# Altium project ZED-F20P-00B Breakout V1.PrjPcb
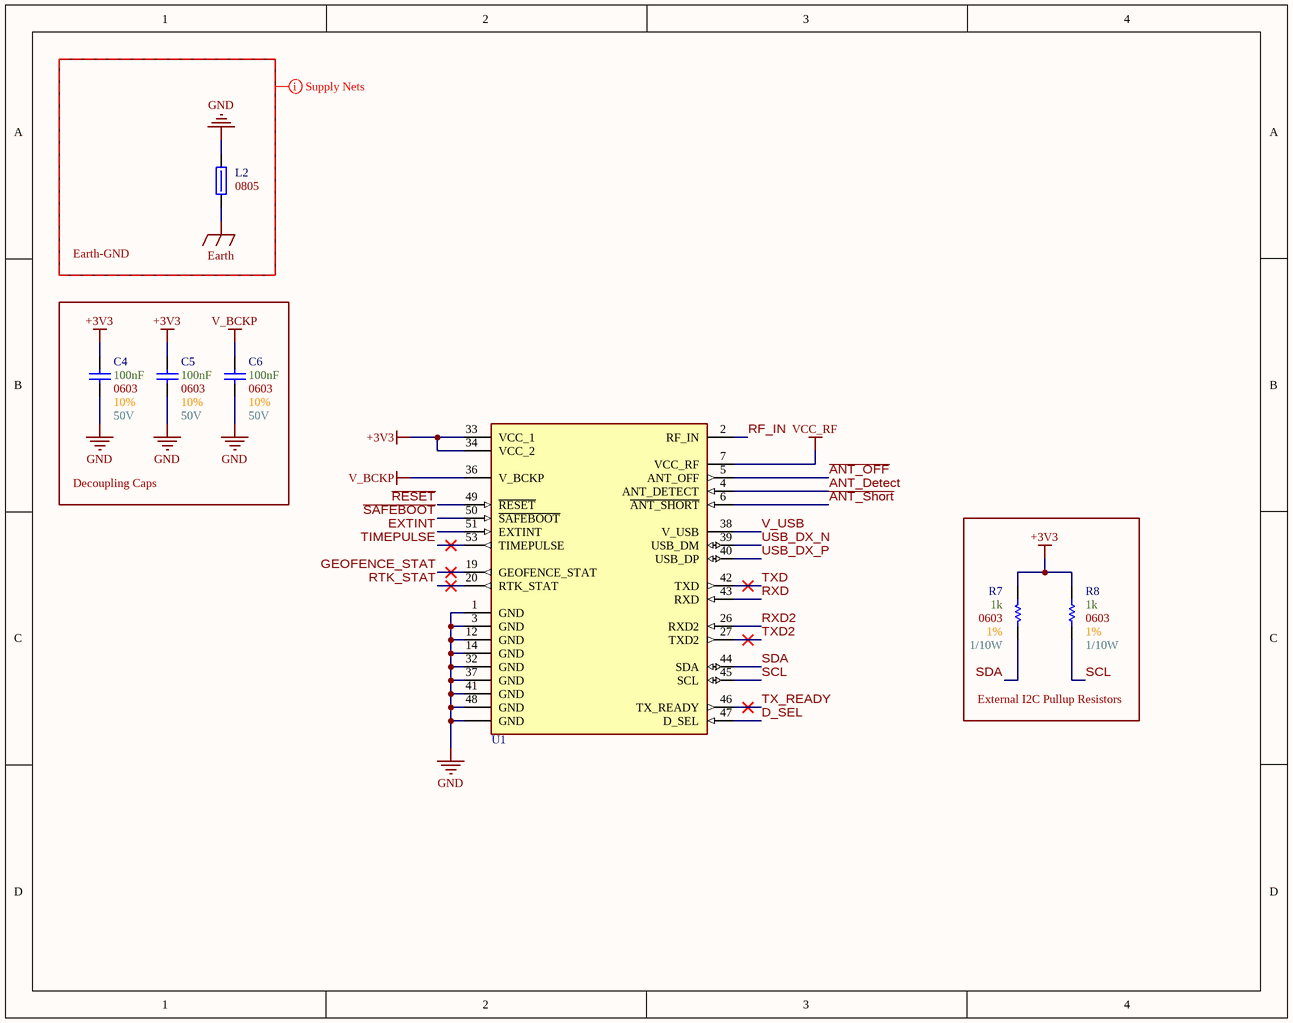
[diagram p0: Main.SchDoc]
6 sheets, 44 parts. Net scope: global (net labels, ports and power ports of the same name join across sheets).
Board file: Layout.PcbDoc
Sheets:
  Main.SchDoc
  USB.SchDoc
  Power.SchDoc
  Antenna Supervisory Circuit.SchDoc
  PIO Isolation.SchDoc
  Breakout Connections.SchDoc

## Sheet Main.SchDoc
size A; SheetNumber: 1; SheetTotal: 6

### Parts
C4  Max Voltage: 50V  Size Package: 0603  Tolerance: 10%  Capacitance: 100nF  [[Cap] SMD 0603]  (hidden comment: [Cap] 0603 0.1uF 10% 50V)
C5  Max Voltage: 50V  Size Package: 0603  Tolerance: 10%  Capacitance: 100nF  [[Cap] SMD 0603]  (hidden comment: [Cap] 0603 0.1uF 10% 50V)
C6  Max Voltage: 50V  Size Package: 0603  Tolerance: 10%  Capacitance: 100nF  [[Cap] SMD 0603]  (hidden comment: [Cap] 0603 0.1uF 10% 50V)
L2  Size Package: 0805  [[Ferrite] SMD 0805]  (hidden comment: 652-MH2029-300Y)
R7  Wattage: 1/10W  Tolerance: 1%  Resistance: 1k  Size Package: 0603  [[Res] SMD 0603]  (hidden comment: [1k] SMD 0603 1% 1/10W)
R8  Wattage: 1/10W  Tolerance: 1%  Resistance: 1k  Size Package: 0603  [[Res] SMD 0603]  (hidden comment: [1k] SMD 0603 1% 1/10W)
U1  High-Precision Triple Band GNSS Module  [[GNSS] ZED-F20P-00B]  (value not drawn)

### Blocks framed on the sheet
Earth-GND: L2
Decoupling Caps: C4-C6
External I2C Pullup Resistors: R7 R8

### Nets
+3V3: C4.2 C5.2 R7.2 R8.2 U1.33(VCC_1) U1.34(VCC_2)
Earth: L2.1
GND: C4.1 C5.1 C6.1 L2.2 U1.1(GND) U1.3(GND) U1.12(GND) U1.14(GND) U1.32(GND) U1.37(GND) U1.41(GND) U1.48(GND) U1.GND
V_BCKP: C6.2 U1.36(V_BCKP)
VCC_RF: U1.7(VCC_RF)
~{ANT_OFF}: U1.5(ANT_OFF)
~{ANT_Short}: U1.6(~{ANT_SHORT})
~{RESET}: U1.49(~{RESET})
~{SAFEBOOT}: U1.50(~{SAFEBOOT})
ANT_Detect: U1.4(ANT_DETECT)
D_SEL: U1.47(D_SEL)
EXTINT: U1.51(EXTINT)
GEOFENCE_STAT: U1.19(GEOFENCE_STAT)
RF_IN: U1.2(RF_IN)
RTK_STAT: U1.20(RTK_STAT)
RXD: U1.43(RXD)
RXD2: U1.26(RXD2)
SCL: R8.1 U1.45(SCL)
SDA: R7.1 U1.44(SDA)
TIMEPULSE: U1.53(TIMEPULSE)
TX_READY: U1.46(TX_READY)
TXD: U1.42(TXD)
TXD2: U1.27(TXD2)
USB_DX_N: U1.39(USB_DM)
USB_DX_P: U1.40(USB_DP)
V_USB: U1.38(V_USB)

### Layout directives
net class Supply_Nets: Earth, GND

### Library data of the parts
C4-C6 = [Cap] 0603 0.1uF 10% 50V: CL10B104KB8NNNC; Supplier 1: DigiKey; Supplier Part Number 1: 1276-1000-6-ND
L2 = [Ferrite] SMD 0805 3A 30ohm: Res @ Freq: 30 @ 100MHz; Supplier 1: DigiKey; Supplier Part Number 1: MH2029-300YCT-ND
R7 R8 = [1k] SMD 0603 1% 1/10W: RMCF0603FT1K00; Supplier 1: DigiKey; Supplier Part Number 1: RMCF0603FT1K00DKR-ND
U1 = [GNSS] ZED-F20P-00B: ZED-F20P-00B; Supplier 1: DigiKey; Supplier Part Number 1: 672-ZED-F20P-00BDKR-ND

## Sheet USB.SchDoc
size A; SheetNumber: 2; SheetTotal: 6
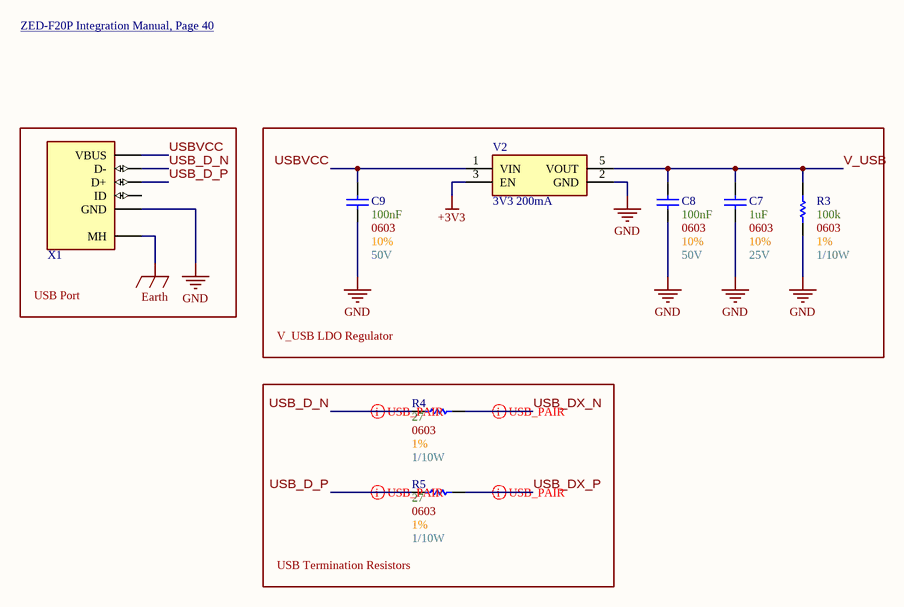
[diagram p1: USB.SchDoc]

### Parts
C7  Max Voltage: 25V  Size Package: 0603  Tolerance: 10%  Capacitance: 1uF  [[Cap] SMD 0603]  (hidden comment: [Cap] 0603 1uF 10% 25V)
C8  Max Voltage: 50V  Size Package: 0603  Tolerance: 10%  Capacitance: 100nF  [[Cap] SMD 0603]  (hidden comment: [Cap] 0603 0.1uF 10% 50V)
C9  Max Voltage: 50V  Size Package: 0603  Tolerance: 10%  Capacitance: 100nF  [[Cap] SMD 0603]  (hidden comment: [Cap] 0603 0.1uF 10% 50V)
R3  Wattage: 1/10W  Tolerance: 1%  Resistance: 100k  Size Package: 0603  [[Res] SMD 0603]  (hidden comment: [100k] SMD 0603 1% 1/10W)
R4  Wattage: 1/10W  Tolerance: 1%  Resistance: 27  Size Package: 0603  [[Res] SMD 0603]  (hidden comment: [27] SMD 0603 1% 1/10W)
R5  Wattage: 1/10W  Tolerance: 1%  Resistance: 27  Size Package: 0603  [[Res] SMD 0603]  (hidden comment: [27] SMD 0603 1% 1/10W)
V2  3V3 200mA  [[Linear] 3V3 0.2A]
X1  [USB] Type-B Mini  [[USB] Type-B Mini]  (value not drawn)

### Blocks framed on the sheet
USB Port: X1
V_USB LDO Regulator: C7-C9 R3 V2
USB Termination Resistors: R4 R5

### Nets
+3V3: V2.3(EN)
Earth: X1.MH
GND: C7.1 C8.1 C9.1 R3.1 V2.2(GND) X1.5(GND)
USB_D_N: R4.1 X1.2(D-)
USB_D_P: R5.1 X1.3(D+)
USB_DX_N: R4.2
USB_DX_P: R5.2
USBVCC: C9.2 V2.1(VIN) X1.1(VBUS)
V_USB: C7.2 C8.2 R3.2 V2.5(VOUT)

Not connected (* = marked no-connect by the designer): X1 4(ID)

### Layout directives
differential pair; differential pair class USB_Pairs: USB_D_N, USB_D_P, USB_DX_N, USB_DX_P

### Notes on the sheet
- ZED-F20P Integration Manual, Page 40 <https://content.u-blox.com/sites/default/files/documents/ZED-F20P_IntegrationManual_UBXDOC-304424225-19671.pdf#page=40>

### Library data of the parts
C7 = [Cap] 0603 1uF 10% 25V: CL10B105KA8NNNC; Supplier 1: DigiKey; Supplier Part Number 1: 1276-1184-1-ND
C8 C9 = [Cap] 0603 0.1uF 10% 50V: CL10B104KB8NNNC; Supplier 1: DigiKey; Supplier Part Number 1: 1276-1000-6-ND
R3 = [100k] SMD 0603 1% 1/10W: RC0603FR-07100KL; Supplier 1: DigiKey; Supplier Part Number 1: 311-100KHRDKR-ND
R4 R5 = [27] SMD 0603 1% 1/10W: MCT06030C2709FP500; Supplier 1: DigiKey; Supplier Part Number 1: 749-1631-1-ND
V2 = [Linear] 3V3 0.2A: TCR2EF33,LM(CT; Supplier 1: DigiKey; Supplier Part Number 1: TCR2EF33LM(CTDKR-ND
X1 = [USB] Type-B Mini: MUSB-05-S-B-SM-A-K-TR; Supplier 1: DigiKey; Supplier Part Number 1: SAM14226CT-ND

## Sheet Power.SchDoc
size A; SheetNumber: 3; SheetTotal: 6
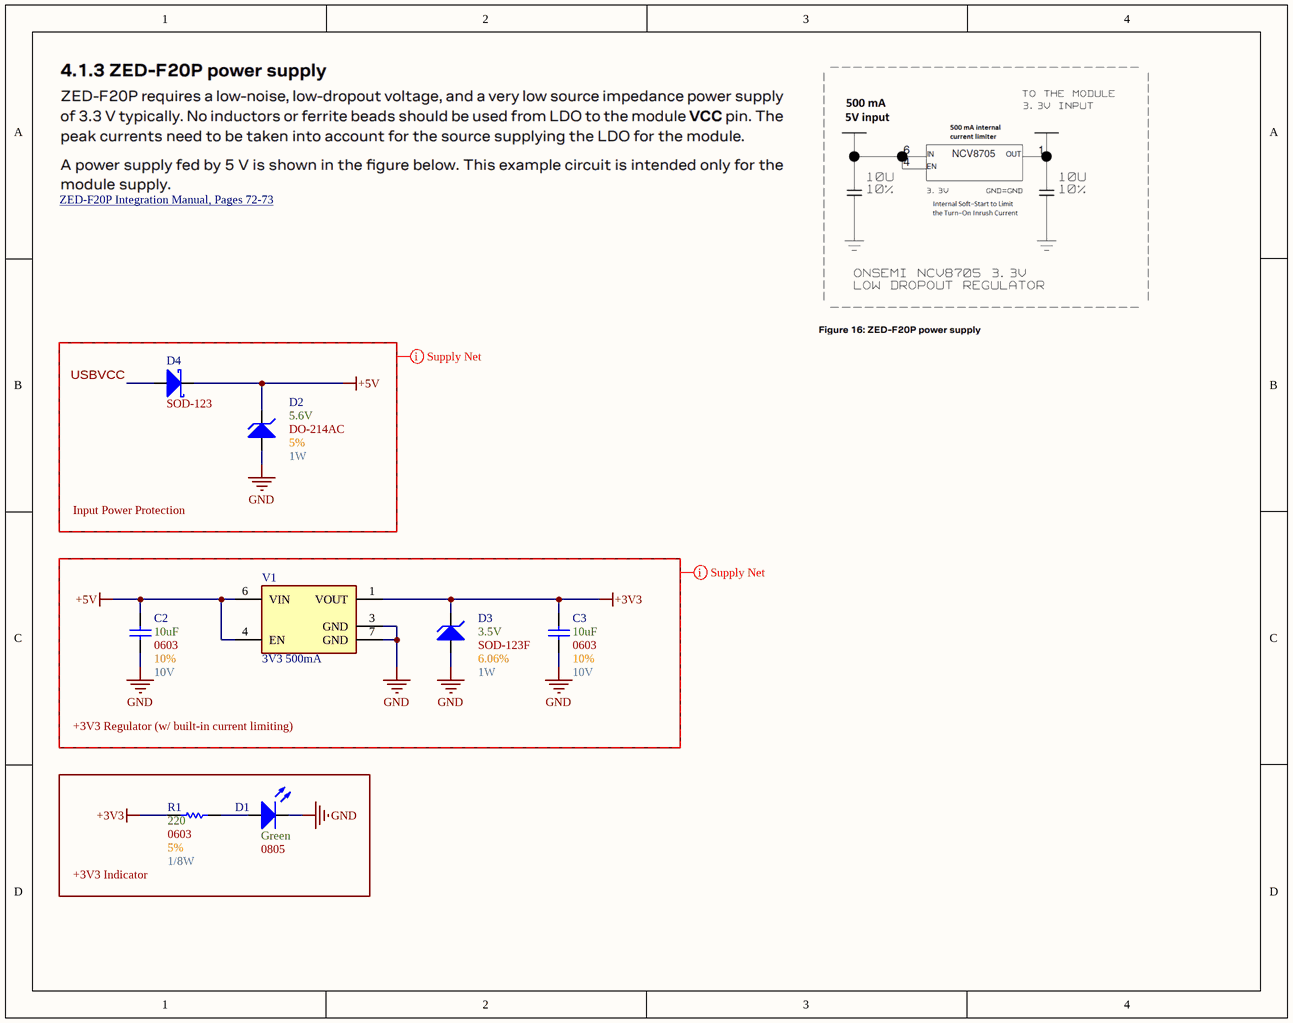
[diagram p2: Power.SchDoc]

### Parts
C2  Max Voltage: 10V  Size Package: 0603  Tolerance: 10%  Capacitance: 10uF  [[Cap] SMD 0603]  (hidden comment: [Cap] 0603 10uF 10% 10V)
C3  Max Voltage: 10V  Size Package: 0603  Tolerance: 10%  Capacitance: 10uF  [[Cap] SMD 0603]  (hidden comment: [Cap] 0603 10uF 10% 10V)
D1  Color: Green  Size Package: 0805  [[LED] SMD 0805]  (hidden comment: [LED] SMD 0805 Green)
D2  Tolerance: 5%  Wattage: 1W  Optimal Zener Voltage: 5.6V  [[Diode] SMD DO-214AC]  (hidden comment: DO-214AC)
D3  Tolerance: 6.06%  Wattage: 1W  Optimal Zener Voltage: 3.5V  [[Diode] SOD-123F]  (hidden comment: SOD-123F)
D4  Footprint: SOD-123  [[Diode] SMD SOD-123]  (hidden comment: SOD123)
R1  Wattage: 1/8W  Tolerance: 5%  Resistance: 220  Size Package: 0603  [[Res] SMD 0603]  (hidden comment: [220] SMD 0603 5% 1/10W)
V1  3V3 500mA  [[Linear] 3V3 0.5A]

### Blocks framed on the sheet
Input Power Protection: D2 D4
+3V3 Regulator (w/ built-in current limiting): C2 C3 D3 V1
+3V3 Indicator: D1 R1

### Nets
+3V3: C3.2 D3.1(K) R1.1 V1.1(VOUT)
+5V: C2.2 D2.1(K) D4.1(K) V1.4(EN) V1.6(VIN)
GND: C2.1 C3.1 D1.2(Cathode) D2.2(A) D3.2(A) V1.3(GND) V1.7(GND)
USBVCC: D4.2(A)
NetD1_1: D1.1(Anode) R1.2

### Layout directives
net class Supply_Nets: +3V3, +5V, GND, USBVCC

### Notes on the sheet
- ZED-F20P Integration Manual, Pages 72-73 <https://content.u-blox.com/sites/default/files/documents/ZED-F20P_IntegrationManual_UBXDOC-304424225-19671.pdf#page=72>

### Library data of the parts
C2 C3 = [Cap] 0603 10uF 10% 10V: CL10A106KP8NNNC; Supplier 1: DigiKey; Supplier Part Number 1: 1276-1192-6-ND
D1 = [LED] SMD 0805 Green: LG R971-KN-1-0-20-R18; Supplier 1: DigiKey; Supplier Part Number 1: 475-LGR971-KN-1CT-ND
D2 = [Zener] SMD 5.6V 1W 5%: SMAZ5V6-13-F; Supplier 1: DigiKey; Supplier Part Number 1: SMAZ5V6-FDICT-ND; Footprint: DO-214AC
D3 = [Zener] SMD 3.5V 1W 6%: KDZVTR3.3B; Supplier 1: DigiKey; Supplier Part Number 1: 846-KDZVTR3.3BCT-ND; Footprint: SOD-123F
D4 = [Schottky] SMD 40V 1A: B5819W-TP; Supplier 1: DigiKey; Supplier Part Number 1: B5819W-TPMSCT-ND
R1 = [220] SMD 0603 5% 1/10W: RK73B1JTTD221J; Supplier 1: DigiKey; Supplier Part Number 1: 2019-RK73B1JTTD221JDKR-ND
V1 = [Linear] 3V3 0.5A: NCV8705MT33TCG; Supplier 1: DigiKey; Supplier Part Number 1: NCV8705MT33TCGOSDKR-ND

## Sheet Antenna Supervisory Circuit.SchDoc
size A; SheetNumber: 4; SheetTotal: 6
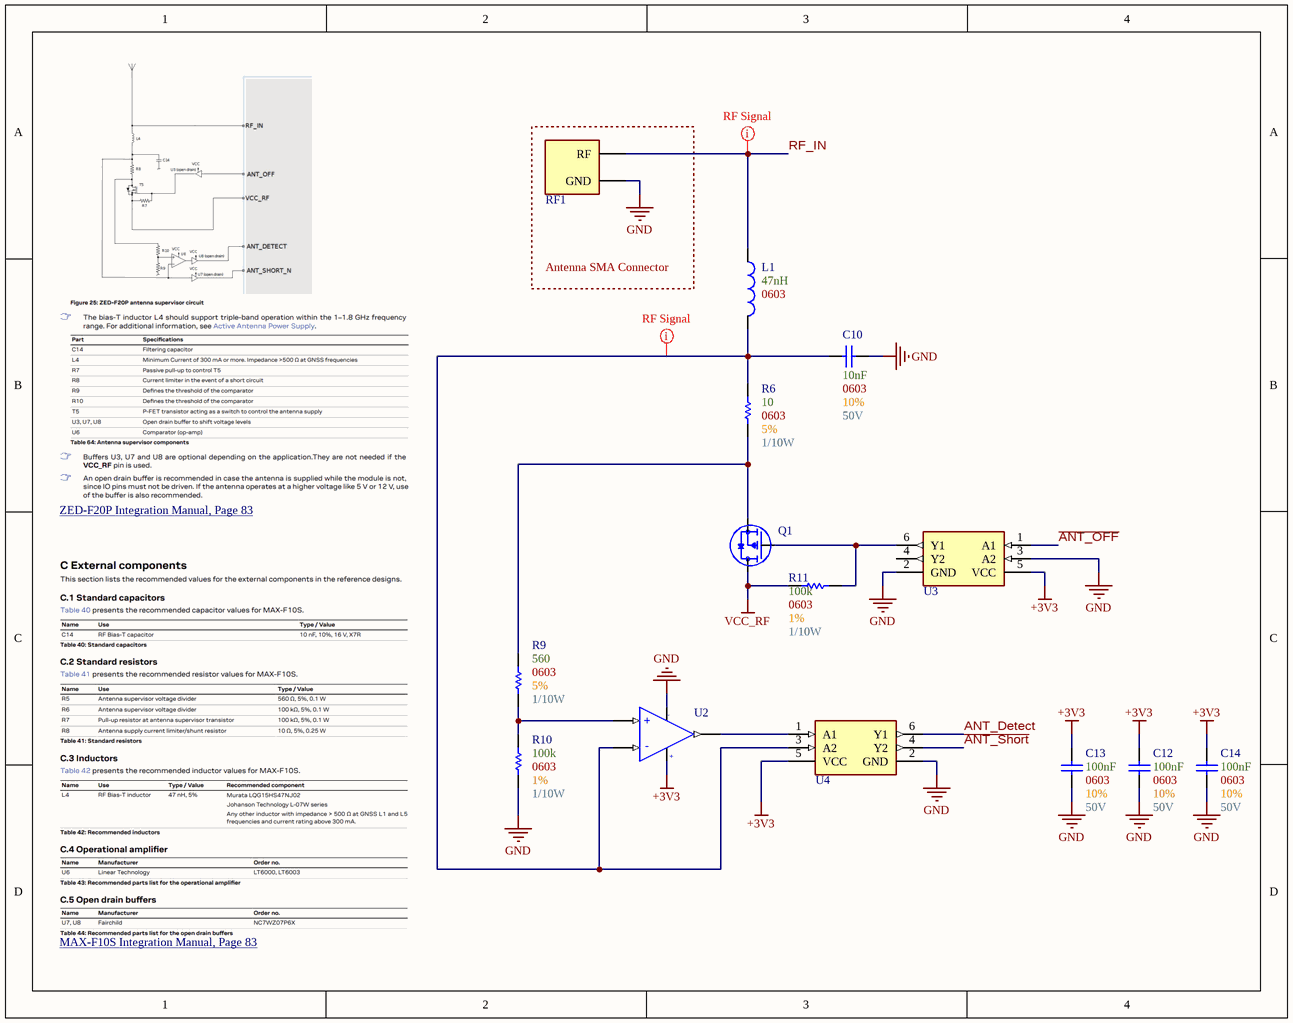
[diagram p3: Antenna Supervisory Circuit.SchDoc]

### Parts
C10  Max Voltage: 50V  Size Package: 0603  Tolerance: 10%  Capacitance: 10nF  [[Cap] SMD 0603]  (hidden comment: [Cap] 0603 0.01uF 10% 50V)
C12  Max Voltage: 50V  Size Package: 0603  Tolerance: 10%  Capacitance: 100nF  [[Cap] SMD 0603]  (hidden comment: [Cap] 0603 0.1uF 10% 50V)
C13  Max Voltage: 50V  Size Package: 0603  Tolerance: 10%  Capacitance: 100nF  [[Cap] SMD 0603]  (hidden comment: [Cap] 0603 0.1uF 10% 50V)
C14  Max Voltage: 50V  Size Package: 0603  Tolerance: 10%  Capacitance: 100nF  [[Cap] SMD 0603]  (hidden comment: [Cap] 0603 0.1uF 10% 50V)
L1  Package: 0603  Inductance: 47nH  [[Inductor] SMD 0603]  (hidden comment: [47nH] SMD 0603 90mA)
Q1  [PMOS] SMD 20V 1A 200mOhm  [SOT323]  (value not drawn)
R6  Wattage: 1/10W  Tolerance: 5%  Resistance: 10  Size Package: 0603  [[Res] SMD 0603]  (hidden comment: [10] SMD 0603 5% 1/10W)
R9  Wattage: 1/10W  Tolerance: 5%  Resistance: 560  Size Package: 0603  [[Res] SMD 0603]  (hidden comment: [560] SMD 0603 5% 1/10W)
R10  Wattage: 1/10W  Tolerance: 1%  Resistance: 100k  Size Package: 0603  [[Res] SMD 0603]  (hidden comment: [100k] SMD 0603 1% 1/10W)
R11  Wattage: 1/10W  Tolerance: 1%  Resistance: 100k  Size Package: 0603  [[Res] SMD 0603]  (hidden comment: [100k] SMD 0603 1% 1/10W)
RF1  [SMA] 90deg Thru-Hole  [[SMA] 90deg Thru-Hole]  (value not drawn)
U2  [Op-Amp] Rail-to-Rail Vmax=16V GBP=3kHz  [[Op-Amp] Rail-to-Rail Vmax=16V GBP=3kHz]  (value not drawn)
U3  [Buffer] Dual Open Drain  [[Buffer] Dual Open Drain]  (value not drawn)
U4  [Buffer] Dual Open Drain  [[Buffer] Dual Open Drain]  (value not drawn)

### Blocks framed on the sheet
Antenna SMA Connector: RF1

### Nets
+3V3: C12.2 C13.2 C14.2 U2.5(V+) U3.5(VCC) U4.5(VCC)
GND: C10.1 C12.1 C13.1 C14.1 R10.1 RF1.2(GND) U2.2(V-) U3.2(GND) U3.3(A2) U4.2(GND)
VCC_RF: Q1.2(Source) R11.2
~{ANT_OFF}: U3.1(A1)
~{ANT_Short}: U4.4(Y2)
ANT_Detect: U4.6(Y1)
RF_IN: L1.1 RF1.1(RF)
NetC10_2: C10.2 L1.2 R6.2 U2.4(-IN) U4.3(A2)
NetQ1_1: Q1.1(Gate) R11.1 U3.6(Y1)
NetQ1_3: Q1.3(Drain) R6.1 R9.2
NetR9_1: R9.1 R10.2 U2.3(+IN)
NetU2_1: U2.1(OUT) U4.1(A1)

Not connected (* = marked no-connect by the designer): U3 4(Y2)

### Layout directives
net class nRF Signal: NetC10_2, RF_IN

### Notes on the sheet
- ZED-F20P Integration Manual, Page 83 <https://content.u-blox.com/sites/default/files/documents/ZED-F20P_IntegrationManual_UBXDOC-304424225-19671.pdf#page=83>
- MAX-F10S Integration Manual, Page 83 <https://content.u-blox.com/sites/default/files/documents/MAX-F10S_IntegrationManual_UBXDOC-963802114-12892.pdf#page=83>
- (in symbol [Op-Amp] Rail-to-Rail Vmax=16V GBP=3kHz) -; +

### Library data of the parts
C10 = [Cap] 0603 0.01uF 10% 50V: C0603C103K5RACTU; Supplier 1: DigiKey; Supplier Part Number 1: 399-C0603C103K5RACTUDKR-ND
C12-C14 = [Cap] 0603 0.1uF 10% 50V: CL10B104KB8NNNC; Supplier 1: DigiKey; Supplier Part Number 1: 1276-1000-6-ND
L1 = [47nH] SMD 0603 90mA: AIMC-0603-47NJ-T; Supplier 1: DigiKey; Supplier Part Number 1: 535-11541-6-ND
Q1 = [PMOS] SMD 20V 1A 200mOhm: PMF170XP,115; Supplier 1: DigiKey; Supplier Part Number 1: 1727-1229-6-ND
R6 = [10] SMD 0603 5% 1/10W: RC0603JR-1310RL; Supplier 1: DigiKey; Supplier Part Number 1: 13-RC0603JR-1310RLDKR-ND
R9 = [560] SMD 0603 5% 1/10W: RC0603JR-07560RL; Supplier 1: DigiKey; Supplier Part Number 1: 311-560GRDKR-ND
R10 R11 = [100k] SMD 0603 1% 1/10W: RC0603FR-07100KL; Supplier 1: DigiKey; Supplier Part Number 1: 311-100KHRDKR-ND
RF1 = [SMA] 90deg Thru-Hole: RFPC-SMA27-F; Supplier 1: DigiKey; Supplier Part Number 1: 2073-RFPC-SMA27-F-ND
U2 = [Op-Amp] Rail-to-Rail Vmax=16V GBP=3kHz: LT6003CS5#TRMPBF; Supplier 1: DigiKey; Supplier Part Number 1: 505-LT6003CS5#TRMPBFCT-ND
U3 U4 = [Buffer] Dual Open Drain: NC7WZ07P6X; Supplier 1: DigiKey; Supplier Part Number 1: NC7WZ07P6XDKR-ND

## Sheet PIO Isolation.SchDoc
size A; SheetNumber: 5; SheetTotal: 6
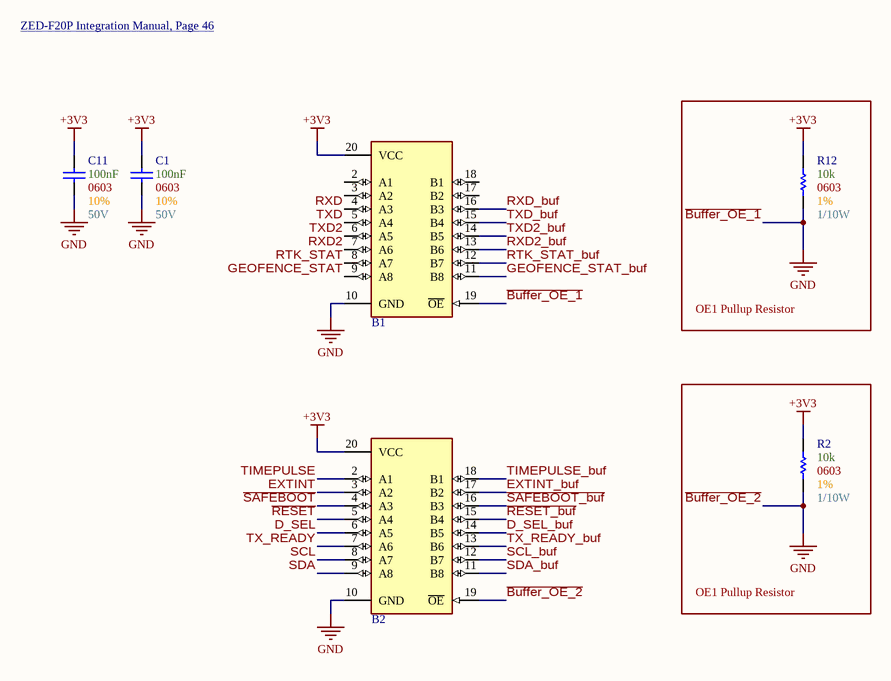
[diagram p4: PIO Isolation.SchDoc]

### Parts
B1  [Isolation Buffer] Bus Switch x8  [[Isolation Buffer] Bus Switch x8]  (value not drawn)
B2  [Isolation Buffer] Bus Switch x8  [[Isolation Buffer] Bus Switch x8]  (value not drawn)
C1  Max Voltage: 50V  Size Package: 0603  Tolerance: 10%  Capacitance: 100nF  [[Cap] SMD 0603]  (hidden comment: [Cap] 0603 0.1uF 10% 50V)
C11  Max Voltage: 50V  Size Package: 0603  Tolerance: 10%  Capacitance: 100nF  [[Cap] SMD 0603]  (hidden comment: [Cap] 0603 0.1uF 10% 50V)
R2  Wattage: 1/10W  Tolerance: 1%  Resistance: 10k  Size Package: 0603  [[Res] SMD 0603]  (hidden comment: [10k] SMD 0603 1% 1/8W)
R12  Wattage: 1/10W  Tolerance: 1%  Resistance: 10k  Size Package: 0603  [[Res] SMD 0603]  (hidden comment: [10k] SMD 0603 1% 1/8W)

### Blocks framed on the sheet
OE1 Pullup Resistor: R12
OE1 Pullup Resistor: R2

### Nets
+3V3: B1.20(VCC) B2.20(VCC) C1.2 C11.2 R2.2 R12.2
GND: B1.10(GND) B1.19(~{OE}) B2.10(GND) B2.19(~{OE}) C1.1 C11.1 R2.1 R12.1  [also labelled ~{Buffer_OE_1}, ~{Buffer_OE_2}]
~{RESET}: B2.5(A4)
~{RESET_buf}: B2.15(B4)
~{SAFEBOOT}: B2.4(A3)
~{SAFEBOOT_buf}: B2.16(B3)
D_SEL: B2.6(A5)
D_SEL_buf: B2.14(B5)
EXTINT: B2.3(A2)
EXTINT_buf: B2.17(B2)
GEOFENCE_STAT: B1.9(A8)
GEOFENCE_STAT_buf: B1.11(B8)
RTK_STAT: B1.8(A7)
RTK_STAT_buf: B1.12(B7)
RXD: B1.4(A3)
RXD2: B1.7(A6)
RXD2_buf: B1.13(B6)
RXD_buf: B1.16(B3)
SCL: B2.8(A7)
SCL_buf: B2.12(B7)
SDA: B2.9(A8)
SDA_buf: B2.11(B8)
TIMEPULSE: B2.2(A1)
TIMEPULSE_buf: B2.18(B1)
TX_READY: B2.7(A6)
TX_READY_buf: B2.13(B6)
TXD: B1.5(A4)
TXD2: B1.6(A5)
TXD2_buf: B1.14(B5)
TXD_buf: B1.15(B4)

Not connected (* = marked no-connect by the designer): B1 2(A1) 3(A2) 17(B2) 18(B1)

### Notes on the sheet
- ZED-F20P Integration Manual, Page 46 <https://content.u-blox.com/sites/default/files/documents/ZED-F20P-00B_DataSheet_UBXDOC-304424225-18270.pdf#page=46>

### Library data of the parts
B1 B2 = [Isolation Buffer] Bus Switch x8: SN74CBTLV3245APWR; Supplier 1: DigiKey; Supplier Part Number 1: 296-9121-1-ND
C1 C11 = [Cap] 0603 0.1uF 10% 50V: CL10B104KB8NNNC; Supplier 1: DigiKey; Supplier Part Number 1: 1276-1000-6-ND
R2 R12 = [10k] SMD 0603 1% 1/8W: RMCF0603FT10K0; Supplier 1: DigiKey; Supplier Part Number 1: RMCF0603FT10K0DKR-ND

## Sheet Breakout Connections.SchDoc
size A; SheetNumber: 6; SheetTotal: 6
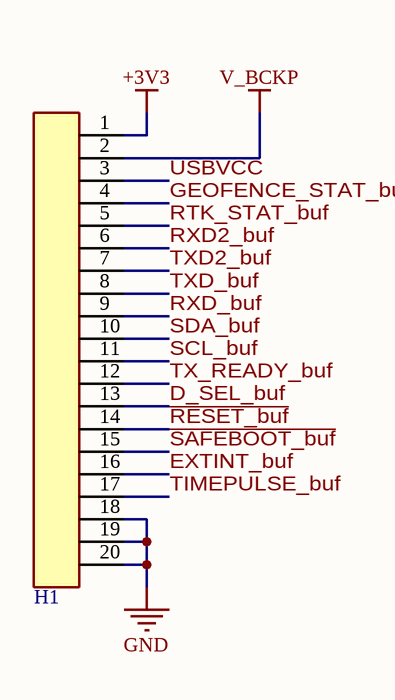
[diagram p5: Breakout Connections.SchDoc]

### Parts
H1  1x20 Header  [[Header] 1x20 Male]  (value not drawn)

### Nets
+3V3: H1.1
GND: H1.18 H1.19 H1.20
V_BCKP: H1.2
~{RESET_buf}: H1.14
~{SAFEBOOT_buf}: H1.15
D_SEL_buf: H1.13
EXTINT_buf: H1.16
GEOFENCE_STAT_buf: H1.4
RTK_STAT_buf: H1.5
RXD2_buf: H1.6
RXD_buf: H1.9
SCL_buf: H1.11
SDA_buf: H1.10
TIMEPULSE_buf: H1.17
TX_READY_buf: H1.12
TXD2_buf: H1.7
TXD_buf: H1.8
USBVCC: H1.3

### Library data of the parts
H1 = [Header] 1x20 Male: 2.54mm pitch

## Nets that join several sheets
+3V3: Main (6 pins), USB (V2.3), Power (C3.2 D3.1 R1.1 V1.1), Antenna Supervisory Circuit (6 pins), PIO Isolation (6 pins), Breakout Connections (H1.1)
Earth: Main (L2.1), USB (X1.MH)
GND: Main (13 pins), USB (6 pins), Power (7 pins), Antenna Supervisory Circuit (10 pins), PIO Isolation (8 pins), Breakout Connections (H1.18 H1.19 H1.20)
V_BCKP: Main (C6.2 U1.36), Breakout Connections (H1.2)
VCC_RF: Main (U1.7), Antenna Supervisory Circuit (Q1.2 R11.2)
~{ANT_OFF}: Main (U1.5), Antenna Supervisory Circuit (U3.1)
~{ANT_Short}: Main (U1.6), Antenna Supervisory Circuit (U4.4)
~{RESET}: Main (U1.49), PIO Isolation (B2.5)
~{RESET_buf}: PIO Isolation (B2.15), Breakout Connections (H1.14)
~{SAFEBOOT}: Main (U1.50), PIO Isolation (B2.4)
~{SAFEBOOT_buf}: PIO Isolation (B2.16), Breakout Connections (H1.15)
ANT_Detect: Main (U1.4), Antenna Supervisory Circuit (U4.6)
D_SEL: Main (U1.47), PIO Isolation (B2.6)
D_SEL_buf: PIO Isolation (B2.14), Breakout Connections (H1.13)
EXTINT: Main (U1.51), PIO Isolation (B2.3)
EXTINT_buf: PIO Isolation (B2.17), Breakout Connections (H1.16)
GEOFENCE_STAT: Main (U1.19), PIO Isolation (B1.9)
GEOFENCE_STAT_buf: PIO Isolation (B1.11), Breakout Connections (H1.4)
RF_IN: Main (U1.2), Antenna Supervisory Circuit (L1.1 RF1.1)
RTK_STAT: Main (U1.20), PIO Isolation (B1.8)
RTK_STAT_buf: PIO Isolation (B1.12), Breakout Connections (H1.5)
RXD: Main (U1.43), PIO Isolation (B1.4)
RXD2: Main (U1.26), PIO Isolation (B1.7)
RXD2_buf: PIO Isolation (B1.13), Breakout Connections (H1.6)
RXD_buf: PIO Isolation (B1.16), Breakout Connections (H1.9)
SCL: Main (R8.1 U1.45), PIO Isolation (B2.8)
SCL_buf: PIO Isolation (B2.12), Breakout Connections (H1.11)
SDA: Main (R7.1 U1.44), PIO Isolation (B2.9)
SDA_buf: PIO Isolation (B2.11), Breakout Connections (H1.10)
TIMEPULSE: Main (U1.53), PIO Isolation (B2.2)
TIMEPULSE_buf: PIO Isolation (B2.18), Breakout Connections (H1.17)
TX_READY: Main (U1.46), PIO Isolation (B2.7)
TX_READY_buf: PIO Isolation (B2.13), Breakout Connections (H1.12)
TXD: Main (U1.42), PIO Isolation (B1.5)
TXD2: Main (U1.27), PIO Isolation (B1.6)
TXD2_buf: PIO Isolation (B1.14), Breakout Connections (H1.7)
TXD_buf: PIO Isolation (B1.15), Breakout Connections (H1.8)
USB_DX_N: Main (U1.39), USB (R4.2)
USB_DX_P: Main (U1.40), USB (R5.2)
USBVCC: USB (C9.2 V2.1 X1.1), Power (D4.2), Breakout Connections (H1.3)
V_USB: Main (U1.38), USB (C7.2 C8.2 R3.2 V2.5)